# EAGLE schematic Gondola_Sail_electronics_M4 (EAGLE 9.4.0)
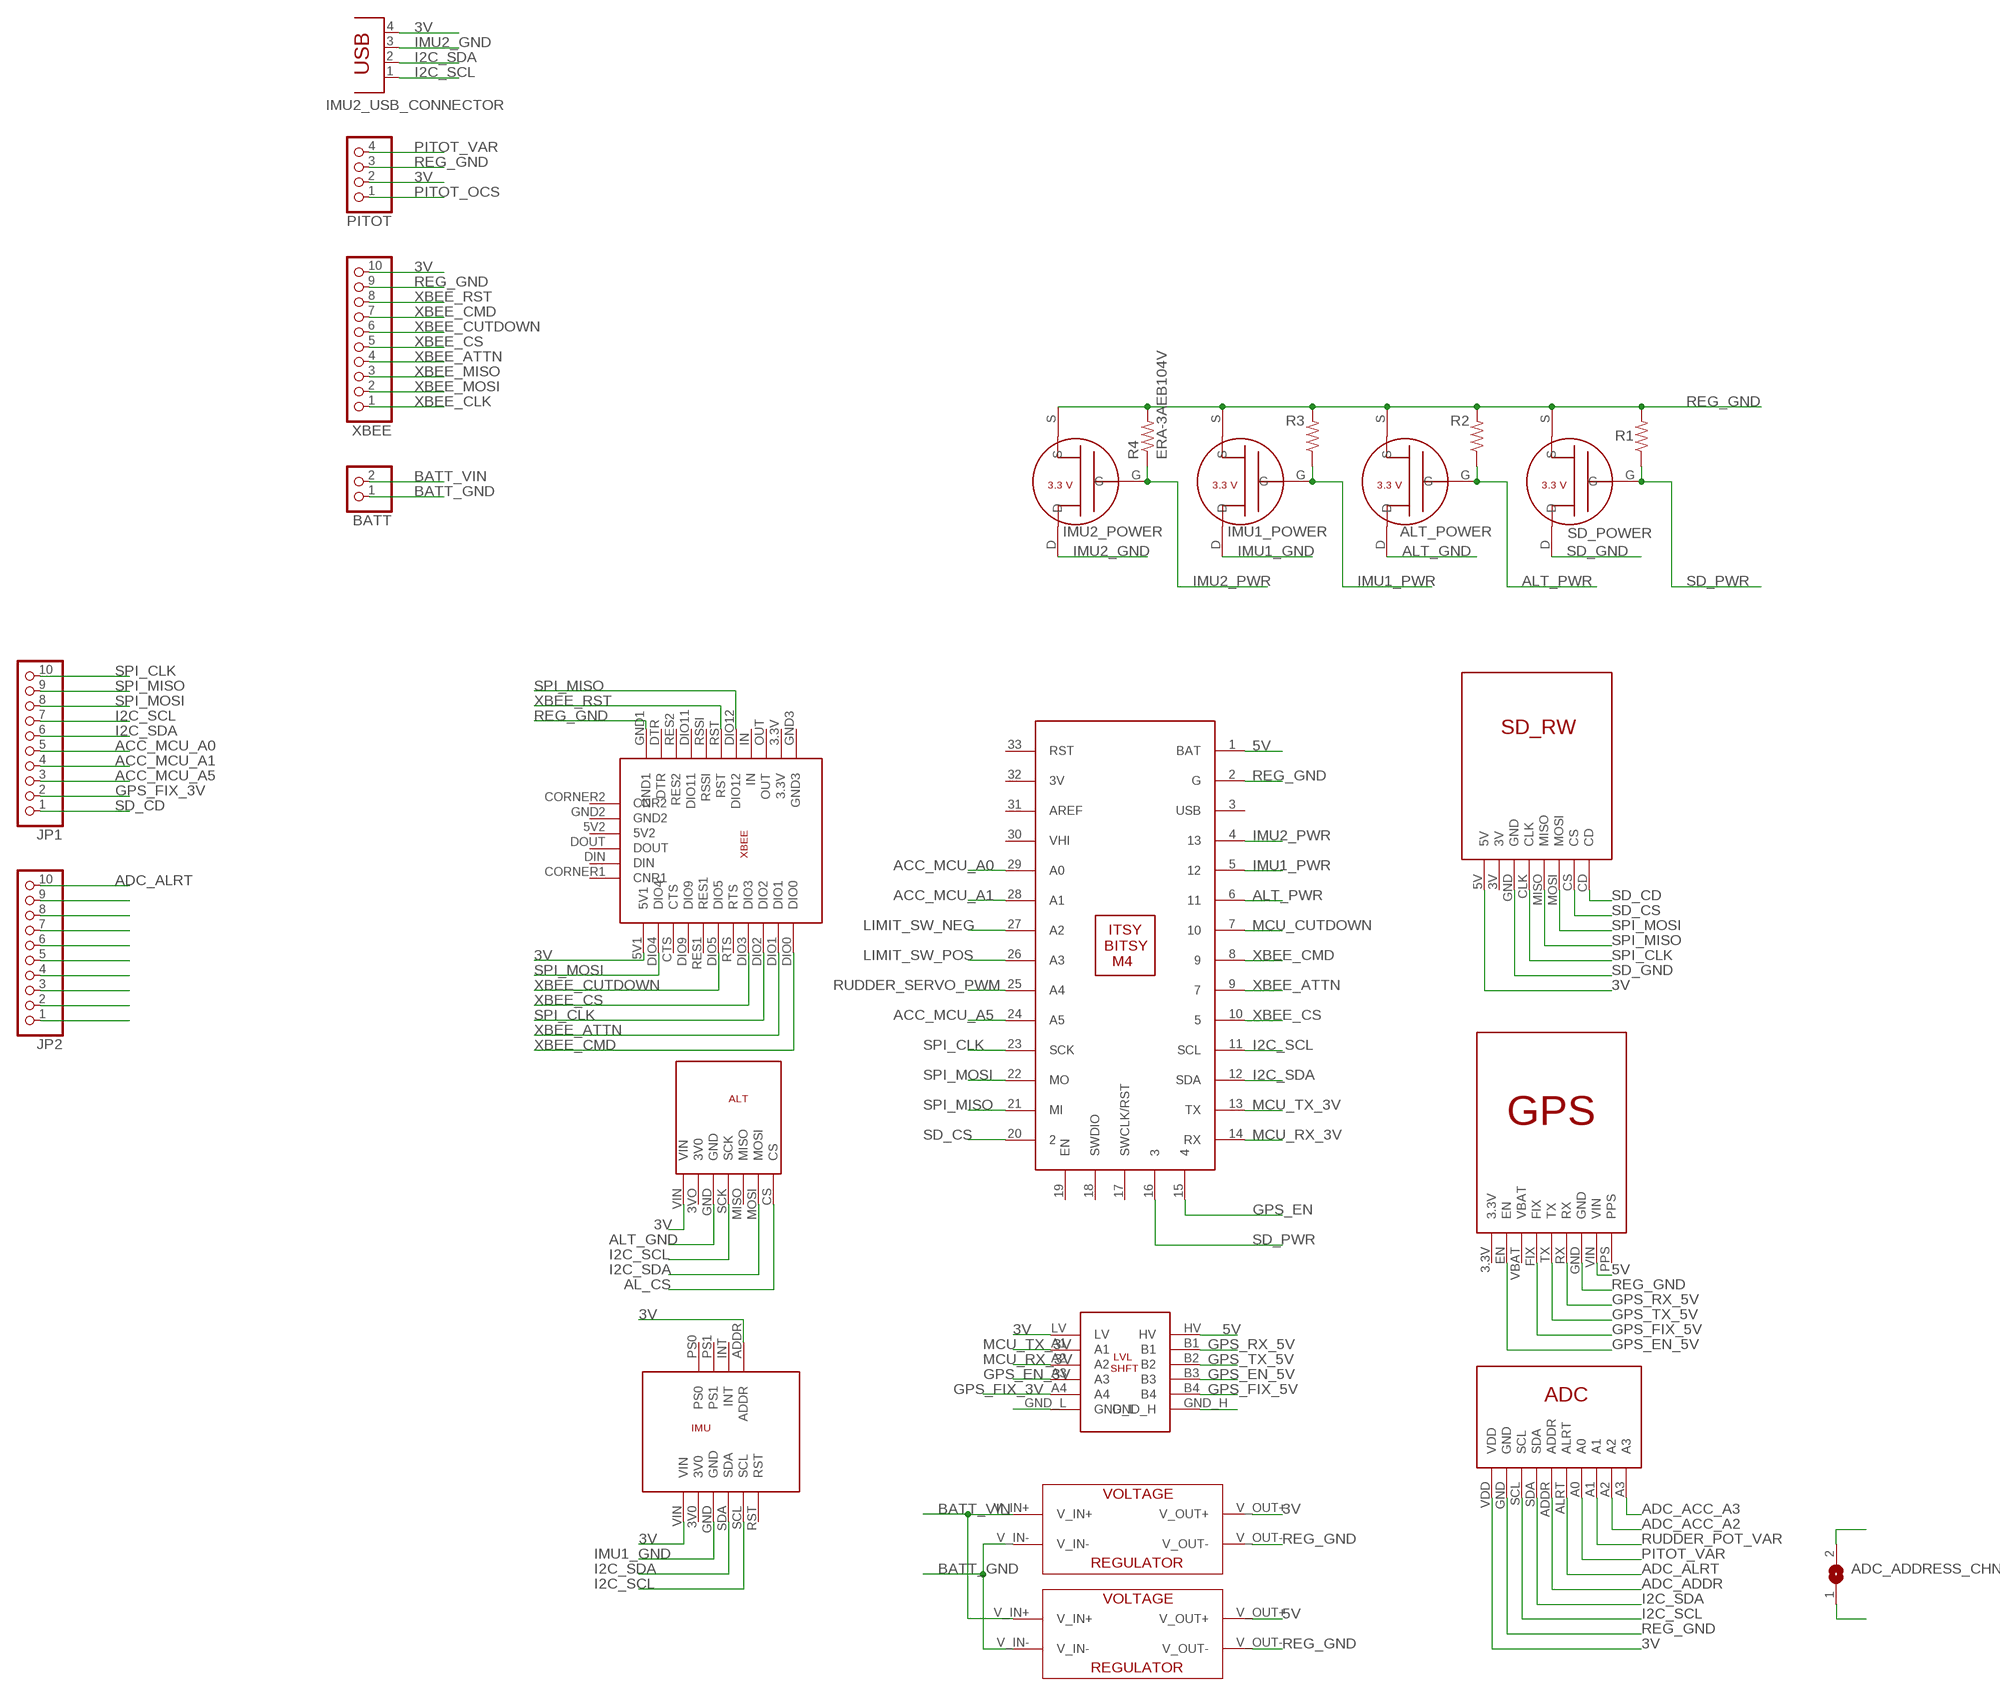
[diagram p0: schematic, sheet 1]

## Parts
3V_REG  3V/5V_REGULATOR  [5V/3V_REGULATOR]
5V_REG  3V/5V_REGULATOR  [5V/3V_REGULATOR]
ADC_ADDRESS_CHNG  SJ  [SJ]
ALT_POWER  3.3V_NCH_FET  [3.3VTRANSISTOR]
BATT  PINHD-1X2/90  [1X02/90]
IMU1  BNO055  [BNO055]
IMU1_POWER  3.3V_NCH_FET  [3.3VTRANSISTOR]
IMU2_POWER  3.3V_NCH_FET  [3.3VTRANSISTOR]
IMU2_USB_CONNECTOR  PN87520  [PN87520]
JP1  PINHD-1X10/90  [1X10/90]
JP2  PINHD-1X10/90  [1X10/90]
PITOT  PINHD-1X4/90  [1X04/90]
R1  ERA-3AEB104V  [RESC1608X55]
R2  ERA-3AEB104V  [RESC1608X55]
R3  ERA-3AEB104V  [RESC1608X55]
R4  ERA-3AEB104V  [RESC1608X55]
SD_POWER  3.3V_NCH_FET  [3.3VTRANSISTOR]
U$1  ADAFRUIT_GPS  [ADAFRUIT_GPS]
U$2  ADAFRUI_SD_RW  [ADAFRUIT_SD_RW]
U$3  ADS1115  [ADS1115]
U$4  BME280  [BME280]
U$6  BSS138_LVLSHIFT  [BSS138_LEVELSHIFT]
U$7  XBEE_XPLORER_REG  [XBEE_EXPLORER_REG'D]
U$8  ITSY_BITSY_M4  [ITSY_BITSY_M4]
XBEE  PINHD-1X10/90  [1X10/90]

## Nets
3V: 3V_REG.V_OUT+ IMU1.ADDR IMU1.VIN IMU2_USB_CONNECTOR.4 PITOT.2 U$2.5V U$3.VDD U$4.VIN U$6.LV U$7.5V1 XBEE.10
5V: 5V_REG.V_OUT+ U$1.VIN U$6.HV U$8.1(BAT)
ACC_MCU_A0: JP1.5 U$8.29(A0)
ACC_MCU_A1: JP1.4 U$8.28(A1)
ACC_MCU_A5: JP1.3 U$8.24(A5)
ADC_ACC_A2: U$3.A2
ADC_ACC_A3: U$3.A3
ADC_ADDR: U$3.ADDR
ADC_ALRT: JP2.10 U$3.ALRT
AL_CS: U$4.CS
ALT_GND: ALT_POWER.D U$4.GND
ALT_PWR: ALT_POWER.G R2.1 U$8.6
BATT_GND: 3V_REG.V_IN- 5V_REG.V_IN- BATT.1
BATT_VIN: 3V_REG.V_IN+ 5V_REG.V_IN+ BATT.2
GPS_EN: U$8.15
GPS_EN_3V: U$6.A3
GPS_EN_5V: U$1.EN U$6.B3
GPS_FIX_3V: JP1.2 U$6.A4
GPS_FIX_5V: U$1.FIX U$6.B4
GPS_RX_5V: U$1.RX U$6.B1
GPS_TX_5V: U$1.TX U$6.B2
I2C_SCL: IMU1.SCL IMU2_USB_CONNECTOR.1 JP1.7 U$3.SCL U$4.SCK U$8.11(SCL)
I2C_SDA: IMU1.SDA IMU2_USB_CONNECTOR.2 JP1.6 U$3.SDA U$4.MOSI U$8.12(SDA)
IMU1_GND: IMU1.GND IMU1_POWER.D
IMU1_PWR: IMU1_POWER.G R3.1 U$8.5
IMU2_GND: IMU2_POWER.D IMU2_USB_CONNECTOR.3
IMU2_PWR: IMU2_POWER.G R4.1 U$8.4
LIMIT_SW_NEG: U$8.27(A2)
LIMIT_SW_POS: U$8.26(A3)
MCU_CUTDOWN: U$8.7
MCU_RX_3V: U$6.A2 U$8.14(RX)
MCU_TX_3V: U$6.A1 U$8.13(TX)
N$1: U$6.GND_L
N$2: U$6.GND_H
N$3: ADC_ADDRESS_CHNG.2
N$4: JP2.9
N$5: JP2.8
N$6: JP2.7
N$7: JP2.6
N$8: JP2.5
N$9: JP2.4
N$10: JP2.3
N$11: JP2.2
N$12: JP2.1
N$13: ADC_ADDRESS_CHNG.1
PITOT_OCS: PITOT.1
PITOT_VAR: PITOT.4 U$3.A0
REG_GND: 3V_REG.V_OUT- 5V_REG.V_OUT- ALT_POWER.S IMU1_POWER.S IMU2_POWER.S PITOT.3 R1.2 R2.2 R3.2 R4.2 SD_POWER.S U$1.GND U$3.GND U$7.GND1 U$8.2(G) XBEE.9
RUDDER_POT_VAR: U$3.A1
RUDDER_SERVO_PWM: U$8.25(A4)
SD_CD: JP1.1 U$2.CD
SD_CS: U$2.CS U$8.20
SD_GND: SD_POWER.D U$2.GND
SD_PWR: R1.1 SD_POWER.G U$8.16
SPI_CLK: JP1.10 U$2.CLK U$7.DIO2 U$8.23(SCK)
SPI_MISO: JP1.9 U$2.MISO U$7.DIO12 U$8.21(MI)
SPI_MOSI: JP1.8 U$2.MOSI U$7.DIO4 U$8.22(MO)
XBEE_ATTN: U$7.DIO1 U$8.9 XBEE.4
XBEE_CLK: XBEE.1
XBEE_CMD: U$7.DIO0 U$8.8 XBEE.7
XBEE_CS: U$7.DIO3 U$8.10 XBEE.5
XBEE_CUTDOWN: U$7.DIO5 XBEE.6
XBEE_MISO: XBEE.3
XBEE_MOSI: XBEE.2
XBEE_RST: U$7.RST XBEE.8
Unconnected: IMU1.3V0 IMU1.INT IMU1.PS0 IMU1.PS1 IMU1.RST U$1.3.3V U$1.PPS U$1.VBAT U$2.3V U$4.3VO(3V0) U$4.MISO U$7.3.3V U$7.5V2 U$7.CORNER1(CNR1) U$7.CORNER2(CNR2) U$7.CTS U$7.DIN U$7.DIO9 U$7.DIO11 U$7.DOUT U$7.DTR U$7.GND2 U$7.GND3 U$7.IN U$7.OUT U$7.RES1 U$7.RES2 U$7.RSSI U$7.RTS U$8.3(USB) U$8.17(SWCLK/RST) U$8.18(SWDIO) U$8.19(EN) U$8.30(VHI) U$8.31(AREF) U$8.32(3V) U$8.33(RST)

## Library data of the parts
3V_REG 5V_REG = Adafruit_Arduino:3V/5V_REGULATOR
ADC_ADDRESS_CHNG = jumper:SJ: SMD solder JUMPER
ALT_POWER IMU1_POWER IMU2_POWER SD_POWER = Adafruit_Arduino:3.3V_NCH_FET
BATT = pinhead:PINHD-1X2: PIN HEADER
IMU1 = Adafruit_Arduino:BNO055
IMU2_USB_CONNECTOR = con-berg:PN87520: BERG USB connector; OC_FARNELL: unknown; OC_NEWARK: unknown
JP1 JP2 XBEE = pinhead:PINHD-1X10: PIN HEADER
PITOT = pinhead:PINHD-1X4: PIN HEADER
R1-R4 = ERA-3AEB104V:ERA-3AEB104V: METAL FILM RESISTOR, 100KOHM, 100mW, 0.1%; DESCRIPTION: Res Thin Film 0603 100K Ohm 0.1% 0.1W_1/10W_ Ø¢±25ppm/Ø¢°C Molded SMD Automotive Punched T/R; DIGI-KEY_PART_NUMBER: P100KDBCT-ND; DIGI-KEY_PURCHASE_URL: https://www.digikey.com/product-detail/en/panasonic-electronic-components/ERA-3AEB104V/P100KDBCT-ND/1466100?utm_source=snapeda&utm_medium=aggregator&utm_campaign=symbol; MF: Panasonic; MP: ERA-3AEB104V; PACKAGE: 0603 Panasonic
U$1 = Adafruit_Arduino:ADAFRUIT_GPS
U$2 = Adafruit_Arduino:ADAFRUI_SD_RW
U$3 = Adafruit_Arduino:ADS1115
U$4 = Adafruit_Arduino:BME280
U$6 = Adafruit_Arduino:BSS138_LVLSHIFT
U$7 = Adafruit_Arduino:XBEE_XPLORER_REG
U$8 = Adafruit_Arduino:ITSY_BITSY_M4